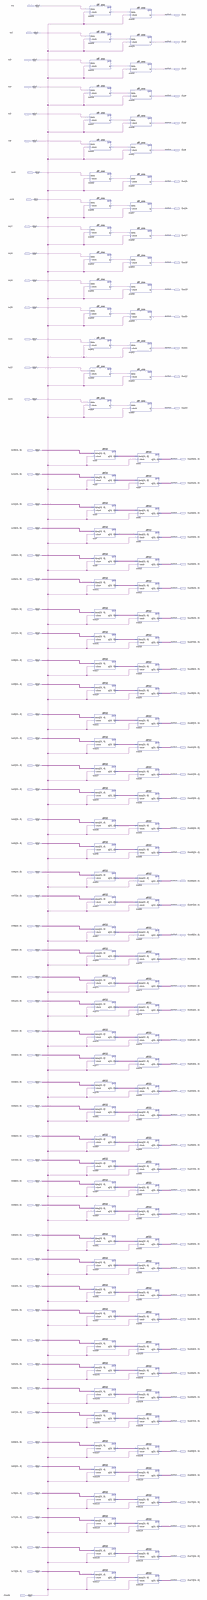
[diagram p0: schematic sheet, whole]
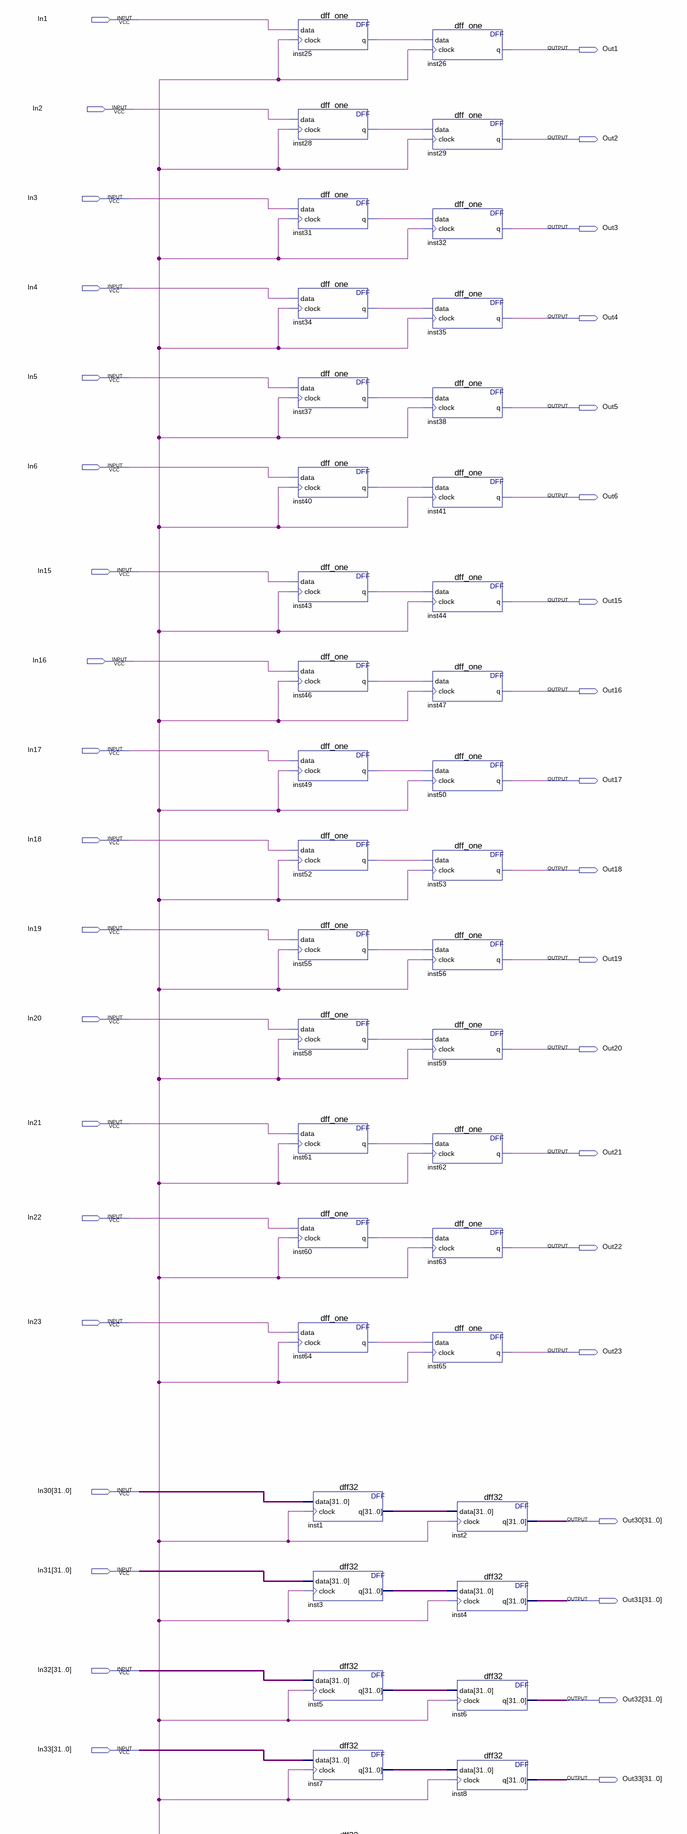
[diagram p1: schematic sheet, upper part]
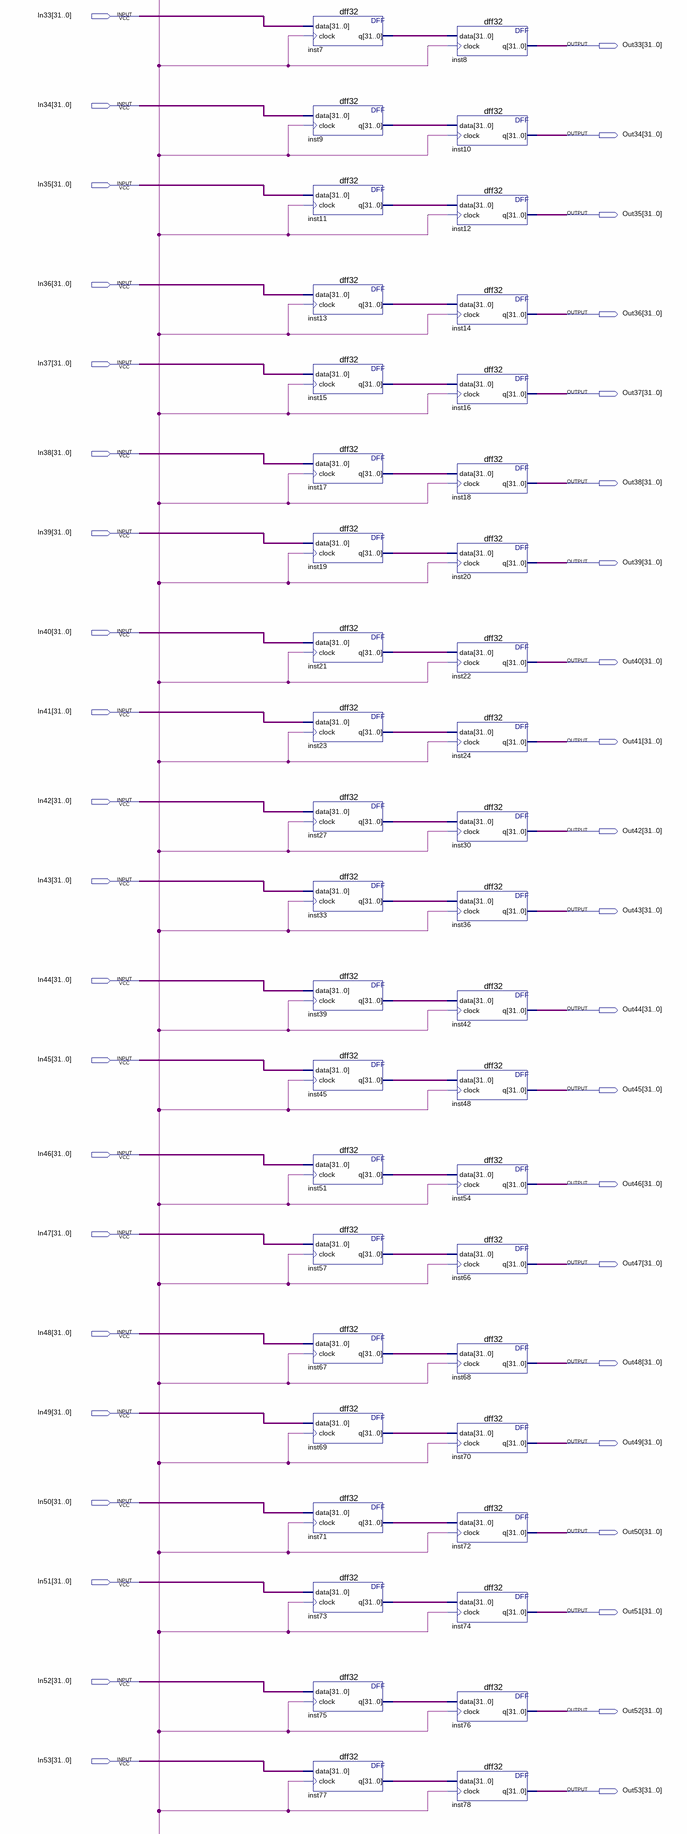
[diagram p2: schematic sheet, middle part]
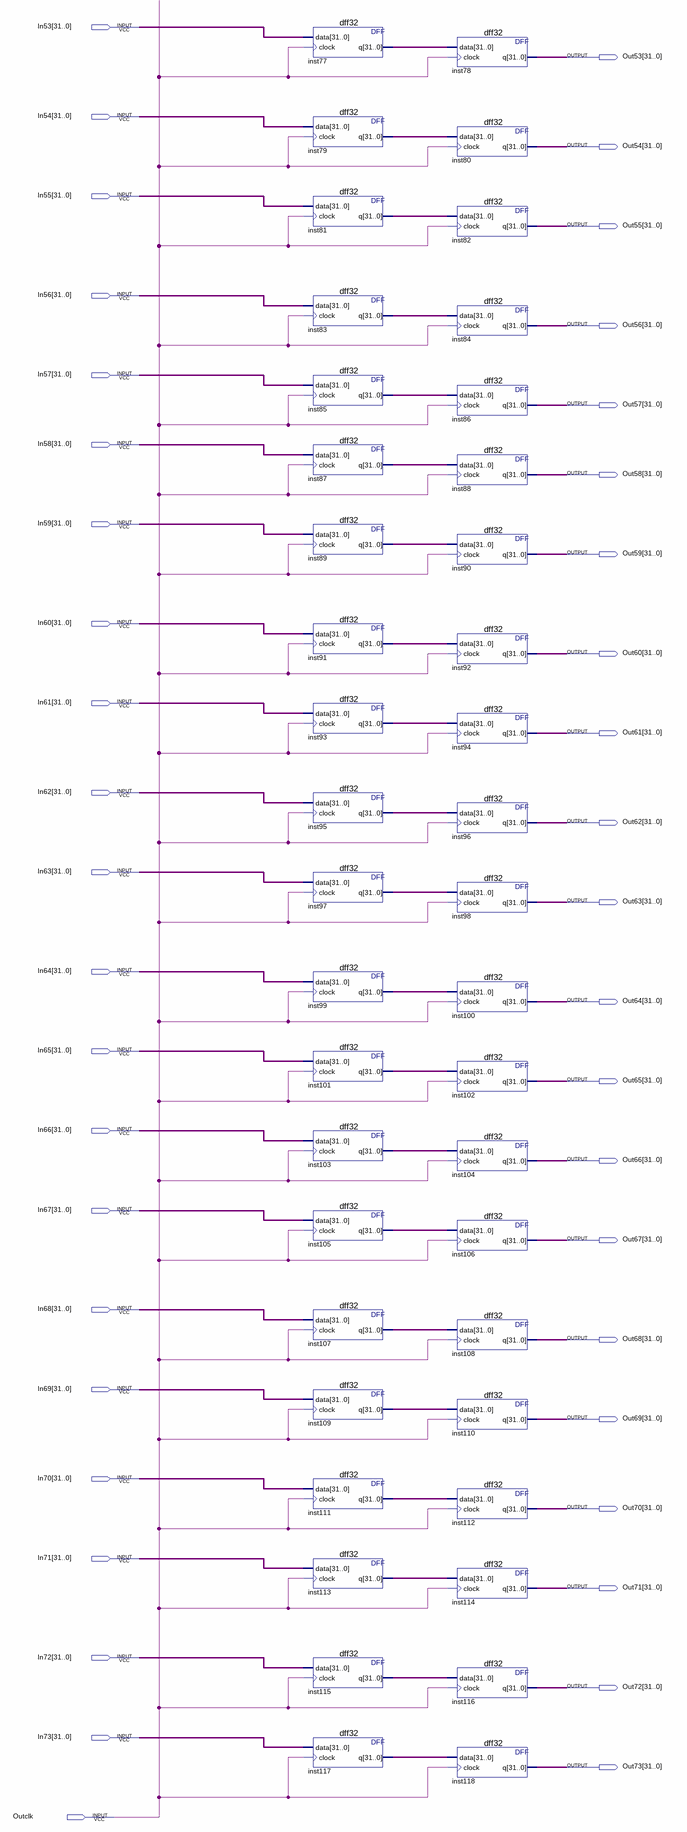
[diagram p3: schematic sheet, lower part]
// Quartus schematic VME_thing.bdf as structural Verilog: 118 symbols, 119 pins
module VME_thing (
  input  In1,
  input  In2,
  input  In3,
  input  In4,
  input  In5,
  input  In6,
  input  In15,
  input  In16,
  input  In17,
  input  In18,
  input  In19,
  input  In20,
  input  In21,
  input  In22,
  input  In23,
  input  [31:0] In30,
  input  [31:0] In31,
  input  [31:0] In32,
  input  [31:0] In33,
  input  [31:0] In34,
  input  [31:0] In35,
  input  [31:0] In36,
  input  [31:0] In37,
  input  [31:0] In38,
  input  [31:0] In39,
  input  [31:0] In40,
  input  [31:0] In41,
  input  [31:0] In42,
  input  [31:0] In43,
  input  [31:0] In44,
  input  [31:0] In45,
  input  [31:0] In46,
  input  [31:0] In47,
  input  [31:0] In48,
  input  [31:0] In49,
  input  [31:0] In50,
  input  [31:0] In51,
  input  [31:0] In52,
  input  [31:0] In53,
  input  [31:0] In54,
  input  [31:0] In55,
  input  [31:0] In56,
  input  [31:0] In57,
  input  [31:0] In58,
  input  [31:0] In59,
  input  [31:0] In60,
  input  [31:0] In61,
  input  [31:0] In62,
  input  [31:0] In63,
  input  [31:0] In64,
  input  [31:0] In65,
  input  [31:0] In66,
  input  [31:0] In67,
  input  [31:0] In68,
  input  [31:0] In69,
  input  [31:0] In70,
  input  [31:0] In71,
  input  [31:0] In72,
  input  [31:0] In73,
  input  Outclk,
  output Out1,
  output Out2,
  output Out3,
  output Out4,
  output Out5,
  output Out6,
  output Out15,
  output Out16,
  output Out17,
  output Out18,
  output Out19,
  output Out20,
  output Out21,
  output Out22,
  output Out23,
  output [31:0] Out30,
  output [31:0] Out31,
  output [31:0] Out32,
  output [31:0] Out33,
  output [31:0] Out34,
  output [31:0] Out35,
  output [31:0] Out36,
  output [31:0] Out37,
  output [31:0] Out38,
  output [31:0] Out39,
  output [31:0] Out40,
  output [31:0] Out41,
  output [31:0] Out42,
  output [31:0] Out43,
  output [31:0] Out44,
  output [31:0] Out45,
  output [31:0] Out46,
  output [31:0] Out47,
  output [31:0] Out48,
  output [31:0] Out49,
  output [31:0] Out50,
  output [31:0] Out51,
  output [31:0] Out52,
  output [31:0] Out53,
  output [31:0] Out54,
  output [31:0] Out55,
  output [31:0] Out56,
  output [31:0] Out57,
  output [31:0] Out58,
  output [31:0] Out59,
  output [31:0] Out60,
  output [31:0] Out61,
  output [31:0] Out62,
  output [31:0] Out63,
  output [31:0] Out64,
  output [31:0] Out65,
  output [31:0] Out66,
  output [31:0] Out67,
  output [31:0] Out68,
  output [31:0] Out69,
  output [31:0] Out70,
  output [31:0] Out71,
  output [31:0] Out72,
  output [31:0] Out73
);

  wire inst25_q, inst28_q, inst31_q, inst34_q, inst37_q, inst40_q, inst43_q, inst46_q, inst49_q, inst52_q,
       inst55_q, inst58_q, inst60_q, inst61_q, inst64_q;
  wire [31:0] inst1_q, inst3_q, inst5_q, inst7_q, inst9_q, inst11_q, inst13_q, inst15_q, inst17_q, inst19_q,
       inst21_q, inst23_q, inst27_q, inst33_q, inst39_q, inst45_q, inst51_q, inst57_q, inst67_q, inst69_q,
       inst71_q, inst73_q, inst75_q, inst77_q, inst79_q, inst81_q, inst83_q, inst85_q, inst87_q, inst89_q,
       inst91_q, inst93_q, inst95_q, inst97_q, inst99_q, inst101_q, inst103_q, inst105_q, inst107_q,
       inst109_q, inst111_q, inst113_q, inst115_q, inst117_q;

  dff_one inst25 (.data(In1), .clock(Outclk), .q(inst25_q));
  dff_one inst28 (.data(In2), .clock(Outclk), .q(inst28_q));
  dff_one inst31 (.data(In3), .clock(Outclk), .q(inst31_q));
  dff_one inst34 (.data(In4), .clock(Outclk), .q(inst34_q));
  dff_one inst37 (.data(In5), .clock(Outclk), .q(inst37_q));
  dff_one inst40 (.data(In6), .clock(Outclk), .q(inst40_q));
  dff_one inst43 (.data(In15), .clock(Outclk), .q(inst43_q));
  dff_one inst46 (.data(In16), .clock(Outclk), .q(inst46_q));
  dff_one inst49 (.data(In17), .clock(Outclk), .q(inst49_q));
  dff_one inst52 (.data(In18), .clock(Outclk), .q(inst52_q));
  dff_one inst55 (.data(In19), .clock(Outclk), .q(inst55_q));
  dff_one inst58 (.data(In20), .clock(Outclk), .q(inst58_q));
  dff_one inst61 (.data(In21), .clock(Outclk), .q(inst61_q));
  dff_one inst60 (.data(In22), .clock(Outclk), .q(inst60_q));
  dff_one inst64 (.data(In23), .clock(Outclk), .q(inst64_q));
  dff32 inst1 (.data(In30), .clock(Outclk), .q(inst1_q));
  dff32 inst3 (.data(In31), .clock(Outclk), .q(inst3_q));
  dff32 inst5 (.data(In32), .clock(Outclk), .q(inst5_q));
  dff32 inst7 (.data(In33), .clock(Outclk), .q(inst7_q));
  dff32 inst9 (.data(In34), .clock(Outclk), .q(inst9_q));
  dff32 inst11 (.data(In35), .clock(Outclk), .q(inst11_q));
  dff32 inst13 (.data(In36), .clock(Outclk), .q(inst13_q));
  dff32 inst15 (.data(In37), .clock(Outclk), .q(inst15_q));
  dff32 inst17 (.data(In38), .clock(Outclk), .q(inst17_q));
  dff32 inst19 (.data(In39), .clock(Outclk), .q(inst19_q));
  dff32 inst21 (.data(In40), .clock(Outclk), .q(inst21_q));
  dff32 inst23 (.data(In41), .clock(Outclk), .q(inst23_q));
  dff32 inst27 (.data(In42), .clock(Outclk), .q(inst27_q));
  dff32 inst33 (.data(In43), .clock(Outclk), .q(inst33_q));
  dff32 inst39 (.data(In44), .clock(Outclk), .q(inst39_q));
  dff32 inst45 (.data(In45), .clock(Outclk), .q(inst45_q));
  dff32 inst51 (.data(In46), .clock(Outclk), .q(inst51_q));
  dff32 inst57 (.data(In47), .clock(Outclk), .q(inst57_q));
  dff32 inst67 (.data(In48), .clock(Outclk), .q(inst67_q));
  dff32 inst69 (.data(In49), .clock(Outclk), .q(inst69_q));
  dff32 inst71 (.data(In50), .clock(Outclk), .q(inst71_q));
  dff32 inst73 (.data(In51), .clock(Outclk), .q(inst73_q));
  dff32 inst75 (.data(In52), .clock(Outclk), .q(inst75_q));
  dff32 inst77 (.data(In53), .clock(Outclk), .q(inst77_q));
  dff32 inst79 (.data(In54), .clock(Outclk), .q(inst79_q));
  dff32 inst81 (.data(In55), .clock(Outclk), .q(inst81_q));
  dff32 inst83 (.data(In56), .clock(Outclk), .q(inst83_q));
  dff32 inst85 (.data(In57), .clock(Outclk), .q(inst85_q));
  dff32 inst87 (.data(In58), .clock(Outclk), .q(inst87_q));
  dff32 inst89 (.data(In59), .clock(Outclk), .q(inst89_q));
  dff32 inst91 (.data(In60), .clock(Outclk), .q(inst91_q));
  dff32 inst93 (.data(In61), .clock(Outclk), .q(inst93_q));
  dff32 inst95 (.data(In62), .clock(Outclk), .q(inst95_q));
  dff32 inst97 (.data(In63), .clock(Outclk), .q(inst97_q));
  dff32 inst99 (.data(In64), .clock(Outclk), .q(inst99_q));
  dff32 inst101 (.data(In65), .clock(Outclk), .q(inst101_q));
  dff32 inst103 (.data(In66), .clock(Outclk), .q(inst103_q));
  dff32 inst105 (.data(In67), .clock(Outclk), .q(inst105_q));
  dff32 inst107 (.data(In68), .clock(Outclk), .q(inst107_q));
  dff32 inst109 (.data(In69), .clock(Outclk), .q(inst109_q));
  dff32 inst111 (.data(In70), .clock(Outclk), .q(inst111_q));
  dff32 inst113 (.data(In71), .clock(Outclk), .q(inst113_q));
  dff32 inst115 (.data(In72), .clock(Outclk), .q(inst115_q));
  dff32 inst117 (.data(In73), .clock(Outclk), .q(inst117_q));
  dff_one inst26 (.data(inst25_q), .clock(Outclk), .q(Out1));
  dff_one inst29 (.data(inst28_q), .clock(Outclk), .q(Out2));
  dff_one inst32 (.data(inst31_q), .clock(Outclk), .q(Out3));
  dff_one inst35 (.data(inst34_q), .clock(Outclk), .q(Out4));
  dff_one inst38 (.data(inst37_q), .clock(Outclk), .q(Out5));
  dff_one inst41 (.data(inst40_q), .clock(Outclk), .q(Out6));
  dff_one inst44 (.data(inst43_q), .clock(Outclk), .q(Out15));
  dff_one inst47 (.data(inst46_q), .clock(Outclk), .q(Out16));
  dff_one inst50 (.data(inst49_q), .clock(Outclk), .q(Out17));
  dff_one inst53 (.data(inst52_q), .clock(Outclk), .q(Out18));
  dff_one inst56 (.data(inst55_q), .clock(Outclk), .q(Out19));
  dff_one inst59 (.data(inst58_q), .clock(Outclk), .q(Out20));
  dff_one inst62 (.data(inst61_q), .clock(Outclk), .q(Out21));
  dff_one inst63 (.data(inst60_q), .clock(Outclk), .q(Out22));
  dff_one inst65 (.data(inst64_q), .clock(Outclk), .q(Out23));
  dff32 inst2 (.data(inst1_q), .clock(Outclk), .q(Out30));
  dff32 inst4 (.data(inst3_q), .clock(Outclk), .q(Out31));
  dff32 inst6 (.data(inst5_q), .clock(Outclk), .q(Out32));
  dff32 inst8 (.data(inst7_q), .clock(Outclk), .q(Out33));
  dff32 inst10 (.data(inst9_q), .clock(Outclk), .q(Out34));
  dff32 inst12 (.data(inst11_q), .clock(Outclk), .q(Out35));
  dff32 inst14 (.data(inst13_q), .clock(Outclk), .q(Out36));
  dff32 inst16 (.data(inst15_q), .clock(Outclk), .q(Out37));
  dff32 inst18 (.data(inst17_q), .clock(Outclk), .q(Out38));
  dff32 inst20 (.data(inst19_q), .clock(Outclk), .q(Out39));
  dff32 inst22 (.data(inst21_q), .clock(Outclk), .q(Out40));
  dff32 inst24 (.data(inst23_q), .clock(Outclk), .q(Out41));
  dff32 inst30 (.data(inst27_q), .clock(Outclk), .q(Out42));
  dff32 inst36 (.data(inst33_q), .clock(Outclk), .q(Out43));
  dff32 inst42 (.data(inst39_q), .clock(Outclk), .q(Out44));
  dff32 inst48 (.data(inst45_q), .clock(Outclk), .q(Out45));
  dff32 inst54 (.data(inst51_q), .clock(Outclk), .q(Out46));
  dff32 inst66 (.data(inst57_q), .clock(Outclk), .q(Out47));
  dff32 inst68 (.data(inst67_q), .clock(Outclk), .q(Out48));
  dff32 inst70 (.data(inst69_q), .clock(Outclk), .q(Out49));
  dff32 inst72 (.data(inst71_q), .clock(Outclk), .q(Out50));
  dff32 inst74 (.data(inst73_q), .clock(Outclk), .q(Out51));
  dff32 inst76 (.data(inst75_q), .clock(Outclk), .q(Out52));
  dff32 inst78 (.data(inst77_q), .clock(Outclk), .q(Out53));
  dff32 inst80 (.data(inst79_q), .clock(Outclk), .q(Out54));
  dff32 inst82 (.data(inst81_q), .clock(Outclk), .q(Out55));
  dff32 inst84 (.data(inst83_q), .clock(Outclk), .q(Out56));
  dff32 inst86 (.data(inst85_q), .clock(Outclk), .q(Out57));
  dff32 inst88 (.data(inst87_q), .clock(Outclk), .q(Out58));
  dff32 inst90 (.data(inst89_q), .clock(Outclk), .q(Out59));
  dff32 inst92 (.data(inst91_q), .clock(Outclk), .q(Out60));
  dff32 inst94 (.data(inst93_q), .clock(Outclk), .q(Out61));
  dff32 inst96 (.data(inst95_q), .clock(Outclk), .q(Out62));
  dff32 inst98 (.data(inst97_q), .clock(Outclk), .q(Out63));
  dff32 inst100 (.data(inst99_q), .clock(Outclk), .q(Out64));
  dff32 inst102 (.data(inst101_q), .clock(Outclk), .q(Out65));
  dff32 inst104 (.data(inst103_q), .clock(Outclk), .q(Out66));
  dff32 inst106 (.data(inst105_q), .clock(Outclk), .q(Out67));
  dff32 inst108 (.data(inst107_q), .clock(Outclk), .q(Out68));
  dff32 inst110 (.data(inst109_q), .clock(Outclk), .q(Out69));
  dff32 inst112 (.data(inst111_q), .clock(Outclk), .q(Out70));
  dff32 inst114 (.data(inst113_q), .clock(Outclk), .q(Out71));
  dff32 inst116 (.data(inst115_q), .clock(Outclk), .q(Out72));
  dff32 inst118 (.data(inst117_q), .clock(Outclk), .q(Out73));
endmodule
